# Altium schematic sheet TMC6200_BOB.SchDoc: TMC6200_BOB
size A3; Author: Waibl Leonhard; SheetNumber: 1; SheetTotal: 1
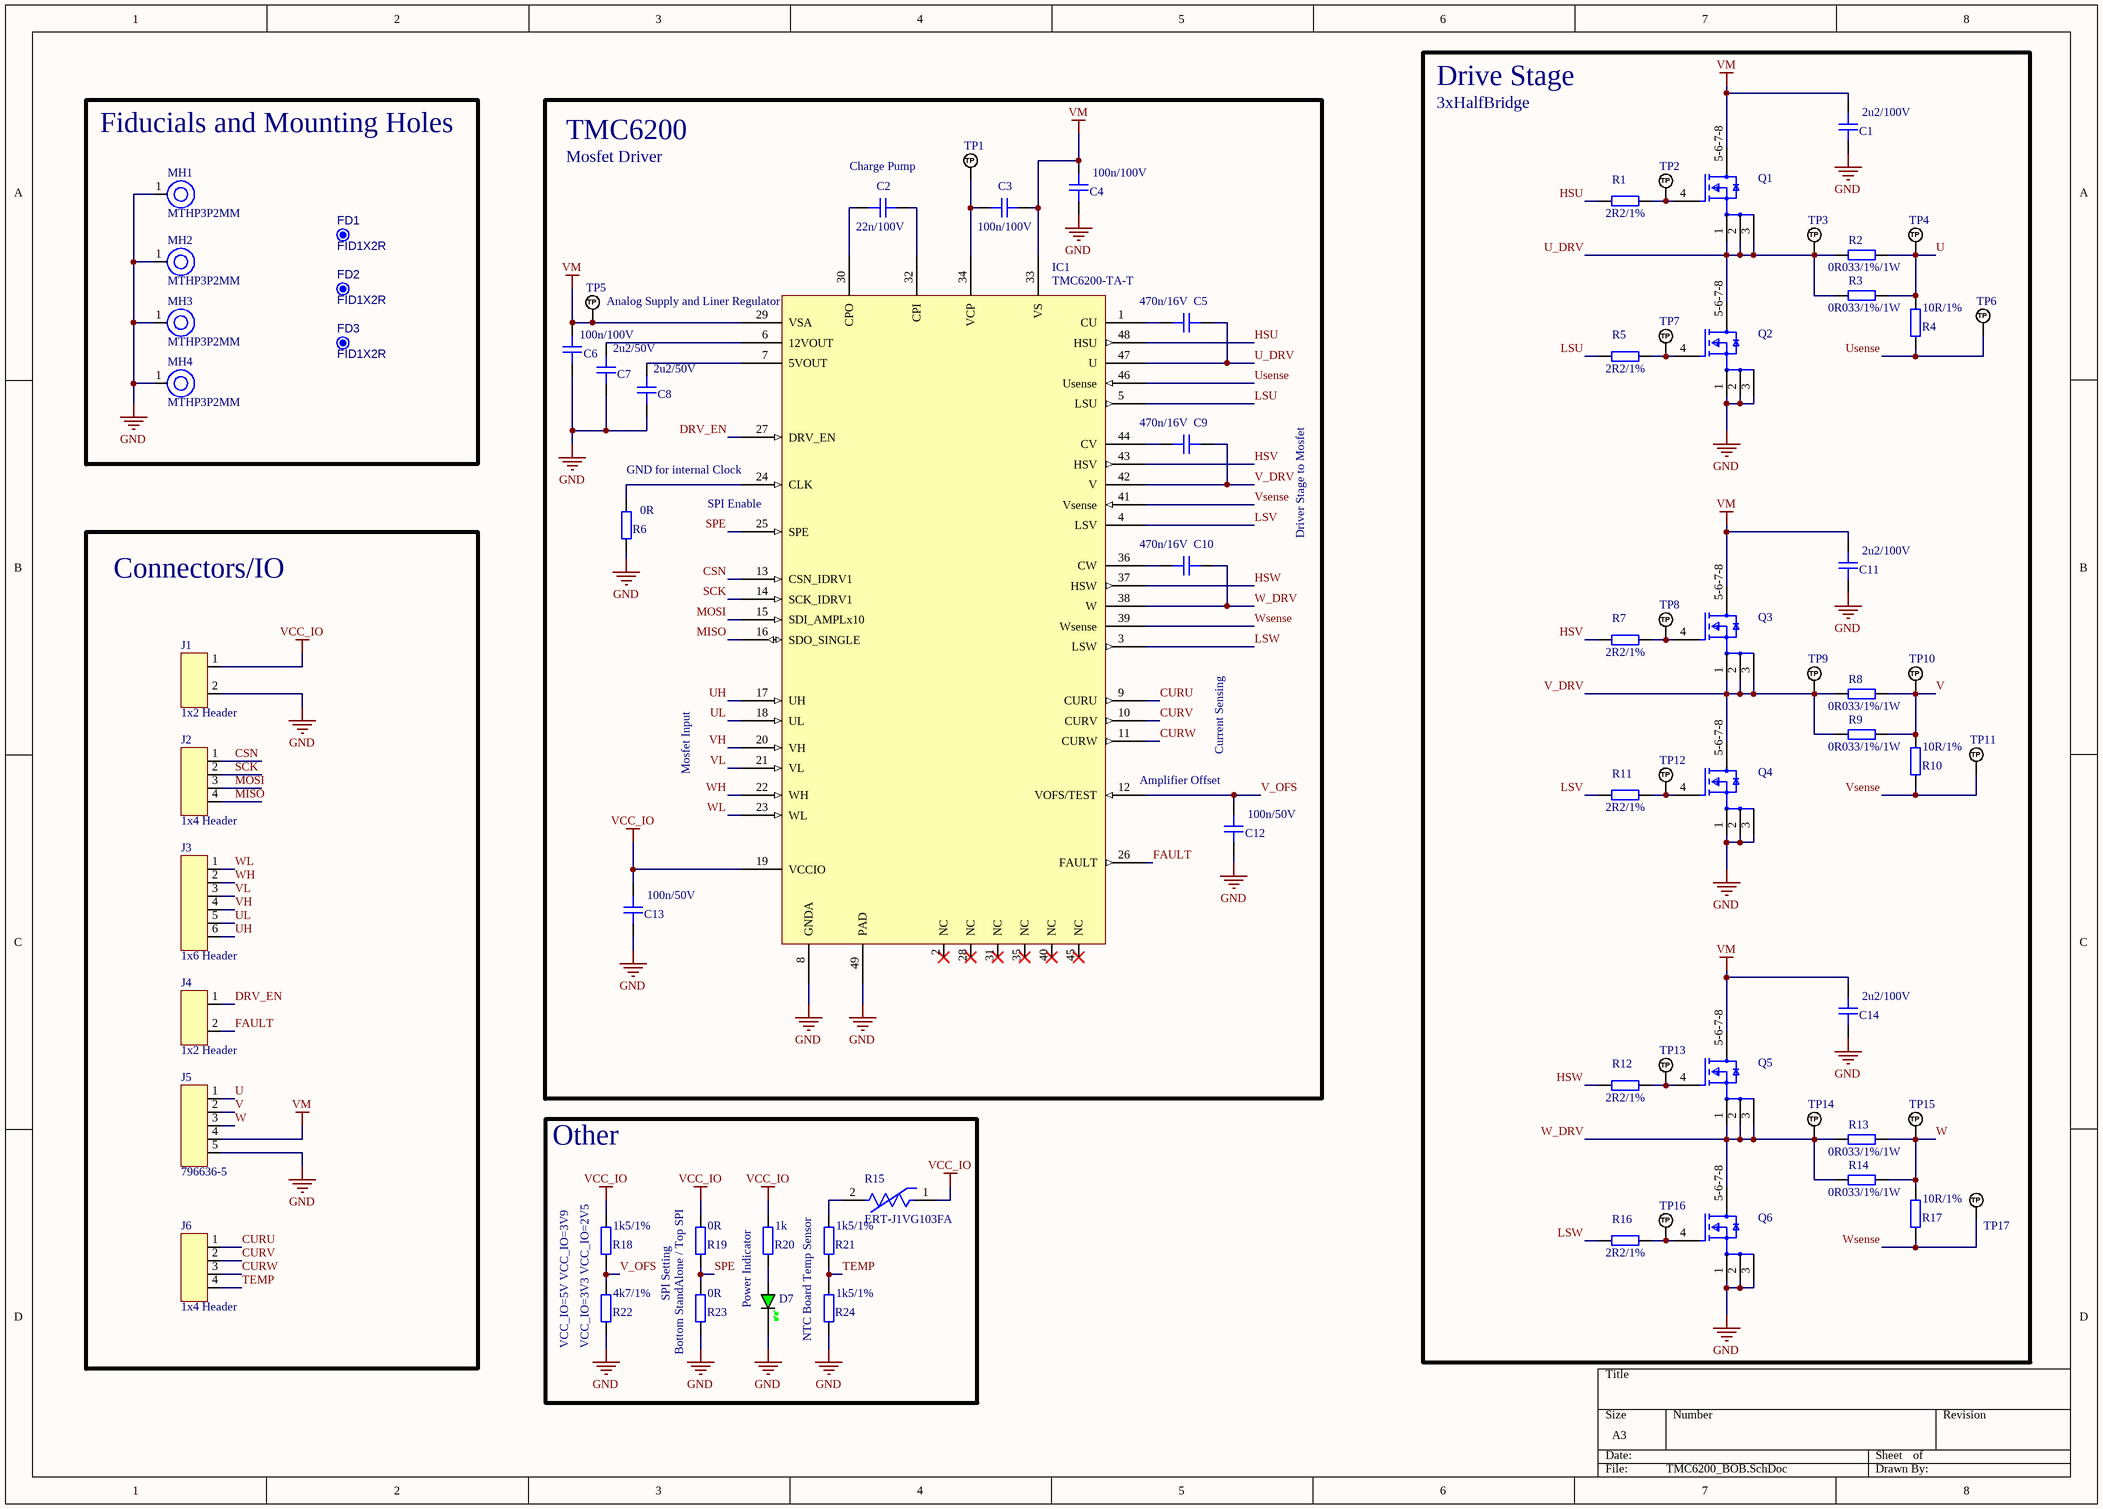
[diagram p0: TMC6200_BOB.SchDoc]

## Parts
C1  2u2/100V  [CAP_1206]
C2  22n/100V  [CAP_0603]
C3  100n/100V  [CAP_0805]
C4  100n/100V  [CAP_0805]
C5  470n/16V  [CAP_0603]
C6  100n/100V  [CAP_0805]
C7  2u2/50V  [CAP_0805]
C8  2u2/50V  [CAP_0805]
C9  470n/16V  [CAP_0603]
C10  470n/16V  [CAP_0603]
C11  2u2/100V  [CAP_1206]
C12  100n/50V  [CAP_0603]
C13  100n/50V  [CAP_0603]
C14  2u2/100V  [CAP_1206]
D7  LED_0805_GREEN  [LED_0805_GREEN]  (value not drawn)
FD1  FID1X2R  [FID1X2R]  (no BOM)
FD2  FID1X2R  [FID1X2R]  (no BOM)
FD3  FID1X2R  [FID1X2R]  (no BOM)
IC1  TMC6200-TA-T  [TSQFP50P900X900X120_HS-49N]
J1  1x2 Header  [1x2 Header-Footprint-1]
J2  1x4 Header  [1x4 Header-Footprint-1]
J3  1x6 Header  [1x6 Header-Footprint-1]
J4  1x2 Header  [1x2 Header-Footprint-1]
J5  796636-5  [796636-5-Footprint-1]
J6  1x4 Header  [1x4 Header-Footprint-1]
MH1  MTHP3P2MM  [MTHP3P2MM-Footprint-1]  (no BOM)
MH2  MTHP3P2MM  [MTHP3P2MM-Footprint-1]  (no BOM)
MH3  MTHP3P2MM  [MTHP3P2MM-Footprint-1]  (no BOM)
MH4  MTHP3P2MM  [MTHP3P2MM-Footprint-1]  (no BOM)
Q1  SIDR626LDP-T1-RE3  [FP-T21-0014-SINGLE-MFG]  (value not drawn)
Q2  SIDR626LDP-T1-RE3  [FP-T21-0014-SINGLE-MFG]  (value not drawn)
Q3  SIDR626LDP-T1-RE3  [FP-T21-0014-SINGLE-MFG]  (value not drawn)
Q4  SIDR626LDP-T1-RE3  [FP-T21-0014-SINGLE-MFG]  (value not drawn)
Q5  SIDR626LDP-T1-RE3  [FP-T21-0014-SINGLE-MFG]  (value not drawn)
Q6  SIDR626LDP-T1-RE3  [FP-T21-0014-SINGLE-MFG]  (value not drawn)
R1  2R2/1%  [RES_0603]
R2  0R033/1%/1W  [RES_1206]
R3  0R033/1%/1W  [RES_1206]
R4  10R/1%  [RES_0603]
R5  2R2/1%  [RES_0603]
R6  0R  [RES_0603]
R7  2R2/1%  [RES_0603]
R8  0R033/1%/1W  [RES_1206]
R9  0R033/1%/1W  [RES_1206]
R10  10R/1%  [RES_0603]
R11  2R2/1%  [RES_0603]
R12  2R2/1%  [RES_0603]
R13  0R033/1%/1W  [RES_1206]
R14  0R033/1%/1W  [RES_1206]
R15  ERT-J1VG103FA  [FP-ERTJ1-MFG]
R16  2R2/1%  [RES_0603]
R17  10R/1%  [RES_0603]
R18  1k5/1%  [RES_0603]
R19  0R  [RES_0603]  (no BOM)
R20  1k  [RES_0603]
R21  1k5/1%  [RES_0603]
R22  4k7/1%  [RES_0603]
R23  0R  [RES_0603]
R24  1k5/1%  [RES_0603]
TP1  TEST_POINT_RND_1MM  [PAD_RND_1MM]  (value not drawn)  (no BOM)
TP2  TEST_POINT_RND_1MM  [PAD_RND_1MM]  (value not drawn)  (no BOM)
TP3  TEST_POINT_RND_1MM  [PAD_RND_1MM]  (value not drawn)  (no BOM)
TP4  TEST_POINT_RND_1MM  [PAD_RND_1MM]  (value not drawn)  (no BOM)
TP5  TEST_POINT_RND_1MM  [PAD_RND_1MM]  (value not drawn)  (no BOM)
TP6  TEST_POINT_RND_1MM  [PAD_RND_1MM]  (value not drawn)  (no BOM)
TP7  TEST_POINT_RND_1MM  [PAD_RND_1MM]  (value not drawn)  (no BOM)
TP8  TEST_POINT_RND_1MM  [PAD_RND_1MM]  (value not drawn)  (no BOM)
TP9  TEST_POINT_RND_1MM  [PAD_RND_1MM]  (value not drawn)  (no BOM)
TP10  TEST_POINT_RND_1MM  [PAD_RND_1MM]  (value not drawn)  (no BOM)
TP11  TEST_POINT_RND_1MM  [PAD_RND_1MM]  (value not drawn)  (no BOM)
TP12  TEST_POINT_RND_1MM  [PAD_RND_1MM]  (value not drawn)  (no BOM)
TP13  TEST_POINT_RND_1MM  [PAD_RND_1MM]  (value not drawn)  (no BOM)
TP14  TEST_POINT_RND_1MM  [PAD_RND_1MM]  (value not drawn)  (no BOM)
TP15  TEST_POINT_RND_1MM  [PAD_RND_1MM]  (value not drawn)  (no BOM)
TP16  TEST_POINT_RND_1MM  [PAD_RND_1MM]  (value not drawn)  (no BOM)
TP17  TEST_POINT_RND_1MM  [PAD_RND_1MM]  (value not drawn)  (no BOM)

## Blocks framed on the sheet
Drive Stage: C1 C11 C14 Q1-Q6 R1-R5 R7-R14 R16 R17 TP2-TP4 TP6-TP17
Fiducials and Mounting Holes: FD1-FD3 MH1-MH4
TMC6200: C2-C10 C12 C13 IC1 R6 TP1 TP5
Connectors/IO: J1-J6
Other: D7 R15 R18-R24

## Nets
GND: C1.1 C4.1 C6.1 C7.1 C8.1 C11.1 C12.1 C13.2 C14.1 D7.K IC1.8(GNDA) IC1.49(PAD) J1.2 J5.5 MH1.1 MH2.1 MH3.1 MH4.1 Q2.1(S) Q2.2(S) Q2.3(S) Q4.1(S) Q4.2(S) Q4.3(S) Q6.1(S) Q6.2(S) Q6.3(S) R6.1 R22.1 R23.1 R24.1
VCC_IO: C13.1 IC1.19(VCCIO) J1.1 R15.1 R18.2 R19.2 R20.2
VM: C1.2 C3.2 C4.2 C6.2 C11.2 C14.2 IC1.29(VSA) IC1.33(VS) J5.4 Q1.5-6-7-8(D) Q3.5-6-7-8(D) Q5.5-6-7-8(D) TP5.1(TP)
CSN: IC1.13(CSN_IDRV1) J2.1
CURU: IC1.9(CURU) J6.1
CURV: IC1.10(CURV) J6.2
CURW: IC1.11(CURW) J6.3
DRV_EN: IC1.27(DRV_EN) J4.1
FAULT: IC1.26(FAULT) J4.2
HSU: IC1.48(HSU) R1.1
HSV: IC1.43(HSV) R7.1
HSW: IC1.37(HSW) R12.1
LSU: IC1.5(LSU) R5.1
LSV: IC1.4(LSV) R11.1
LSW: IC1.3(LSW) R16.1
MISO: IC1.16(SDO_SINGLE) J2.4
MOSI: IC1.15(SDI_AMPLx10) J2.3
SCK: IC1.14(SCK_IDRV1) J2.2
SPE: IC1.25(SPE) R19.1 R23.2
TEMP: J6.4 R21.1 R24.2
U: J5.1 R2.2 R3.2 R4.2 TP4.1(TP)
U_DRV: C5.2 IC1.47(U) Q1.1(S) Q1.2(S) Q1.3(S) Q2.5-6-7-8(D) R2.1 R3.1 TP3.1(TP)
UH: IC1.17(UH) J3.6
UL: IC1.18(UL) J3.5
Usense: IC1.46(Usense) R4.1 TP6.1(TP)
V: J5.2 R8.2 R9.2 R10.2 TP10.1(TP)
V_DRV: C9.2 IC1.42(V) Q3.1(S) Q3.2(S) Q3.3(S) Q4.5-6-7-8(D) R8.1 R9.1 TP9.1(TP)
V_OFS: C12.2 IC1.12(VOFS/TEST) R18.1 R22.2
VH: IC1.20(VH) J3.4
VL: IC1.21(VL) J3.3
Vsense: IC1.41(Vsense) R10.1 TP11.1(TP)
W: J5.3 R13.2 R14.2 R17.2 TP15.1(TP)
W_DRV: C10.2 IC1.38(W) Q5.1(S) Q5.2(S) Q5.3(S) Q6.5-6-7-8(D) R13.1 R14.1 TP14.1(TP)
WH: IC1.22(WH) J3.2
WL: IC1.23(WL) J3.1
Wsense: IC1.39(Wsense) R17.1 TP17.1(TP)
NetC2_1: C2.1 IC1.30(CPO)
NetC2_2: C2.2 IC1.32(CPI)
NetC3_1: C3.1 IC1.34(VCP) TP1.1(TP)
NetC5_1: C5.1 IC1.1(CU)
NetC7_2: C7.2 IC1.6(12VOUT)
NetC8_2: C8.2 IC1.7(5VOUT)
NetC9_1: C9.1 IC1.44(CV)
NetC10_1: C10.1 IC1.36(CW)
NetD7_A: D7.A R20.1
NetIC1_24: IC1.24(CLK) R6.2
NetQ1_4: Q1.4(G) R1.2 TP2.1(TP)
NetQ2_4: Q2.4(G) R5.2 TP7.1(TP)
NetQ3_4: Q3.4(G) R7.2 TP8.1(TP)
NetQ4_4: Q4.4(G) R11.2 TP12.1(TP)
NetQ5_4: Q5.4(G) R12.2 TP13.1(TP)
NetQ6_4: Q6.4(G) R16.2 TP16.1(TP)
NetR15_2: R15.2 R21.2

Not connected (* = marked no-connect by the designer): IC1 2(NC)* 28(NC)* 31(NC)* 35(NC)* 40(NC)* 45(NC)*

## Notes on the sheet
- 3xHalfBridge
- Mosfet Driver
- Charge Pump
- (near IC1) Analog Supply and Liner Regulator
- GND for internal Clock
- (near IC1) SPI Enable
- Driver Stage to Mosfet
- Mosfet Input
- Amplifier Offset
- Current Sensing
- SPI Setting
- Power Indicator
- VCC_IO=5V VCC_IO=3V9
- VCC_IO=3V3 VCC_IO=2V5
- Bottom StandAlone / Top SPI
- NTC Board Temp Sensor

## Library data of the parts
C1 C11 C14 = CMP-001-00089-1: Capacitor SMD 1206; LCSC: *; Dielectric: *; Manufacturer: *; Distributor Link: *; Source: Schematic-Lib-PhilsLab.SchLib; Design Item ID: CAP_1206; Manufacturer Part Number: *; Rating: *
C2 C5 C9 C10 C12 C13 = CMP-001-00087-1: Capacitor SMD 0603; Dielectric: *; Rating: *; Design Item ID: CAP_0603; Source: Schematic-Lib-PhilsLab.SchLib; LCSC: *; Manufacturer: *; Manufacturer Part Number: *; Distributor Link: *
C3 C4 C6-C8 = CMP-001-00088-1: Capacitor SMD 0805; Rating: *; Design Item ID: CAP_0805; Manufacturer: *; Source: Schematic-Lib-PhilsLab.SchLib; Dielectric: *; LCSC: *; Manufacturer Part Number: *; Distributor Link: *
D7 = CMP-004-00052-1: LED 0805 GREEN SMD; LCSC: *; Distributor Link: *; Manufacturer Part Number: *; Source: Schematic-Lib-PhilsLab.SchLib; Design Item ID: LED_0805_GREEN; Manufacturer: *
FD1-FD3 = CMP-00028-00005-2: Fiducial - Round 1x2mm; Pins: 0
IC1 = CMP-00024-00013-6: Surface Mount Tape & Reel (TR) Active Gate Drivers ICs CMOS 6 85V V 48-TQFP Exposed Pad Half-Bridge
J1 J4 = CMP-002-00330-3: TE 5-146280-2, PCB Mount Header, Vertical, Board-to-Board, 2 Position, 2.54 mm [.1 in] Centerline, Breakaway, Gold, Through Hole - Solder, Signal, AMPMODU Headers
J2 J6 = CMP-002-00328-4: TE 5-146280-3, PCB Mount Header, Vertical, Board-to-Board, 3 Position, 2.54 mm [.1 in] Centerline, Breakaway, Gold, Through Hole - Solder, Signal, AMPMODU Headers
J3 = CMP-002-00329-3: TE 5-146280-6, PCB Mount Header, Vertical, Board-to-Board, 6 Position, 2.54 mm [.1 in] Centerline, Breakaway, Gold, Through Hole - Solder, Signal, Black, Carton
J5 = CMP-002-00327-2: PCB Terminal Blocks, Header, Wire-to-Board, 5 Position, .2 in [5.08 mm] Centerline, 1 Row, 30 – 12 AWG Wire Size, .05 – 3 mm² Wire Size; Max Current Rating: 15A; Voltage Rating: 300V; Mounting Technology: Board; RoHS Compliant: Yes
MH1-MH4 = CMP-00028-00009-2: Mounting Hole Plated 3.2 mm drill
Q1-Q6 = CMP-013-00035-3: Mosfet, N-Ch, 60V, 204A, Powerpak So Rohs Compliant: Yes; Pins: 8; Case/Package: Powerpak; Mounting Technology: SMT; Transistor Type: mosfet
R1 R4-R7 R10-R12 R16-R24 = CMP-009-00179-2: Resistor SMD 0603; Design Item ID: RES_0603; Manufacturer Part Number: *; Manufacturer: *; Distributor Link: *; Source: Schematic-Lib-PhilsLab.SchLib; LCSC: *
R2 R3 R8 R9 R13 R14 = CMP-009-00181-2: Resistor SMD 1206; Manufacturer Part Number: *; Distributor Link: *; Source: Schematic-Lib-PhilsLab.SchLib; LCSC: *; Design Item ID: RES_1206; Manufacturer: *
R15 = CMP-05419-000001-1: THERMISTOR NTC 10KOHM 3380K 0603; Resistance: 10kR; Max Power Dissipation: 100mW; Resistance Tolerance: 1%; Case Code (Imperial): 0603; Height: 0.8mm; Case/Package: 0603; Depth: 0.8mm; Min Operating Temperature: -40°C; Accuracy: 1%; Series: ERT-J; Termination: SMD/SMT; Length: 1.6mm; Number of Pins: 2; Lead Free: Lead Free; Power Rating: 100mW; Package Quantity: 4000; RoHS Compliant: Yes; Max Operating Temperature: 125°C; Width: 800um; REACH SVHC: No SVHC; Packaging: Tape and Reel; Tolerance: 1%; Mount: Surface Mount; Case Code (Metric): 1608; Radiation Hardening: No
TP1-TP17 = CMP-023-000001-1: Test Point Round 1mm (NO BOM); Design Item ID: TEST_POINT_RND_1MM; Source: Schematic-Lib-PhilsLab.SchLib